# EAGLE schematic regulator (EAGLE 9.6.2)
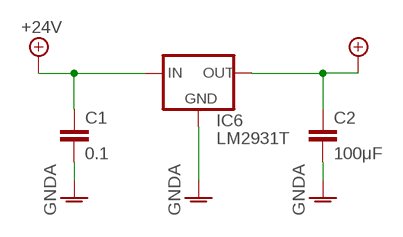
[diagram p0: schematic, sheet 1]

## Parts
C1  0.1  C2,5-3  [C2.5-3]
C2  100μF  C2,5-3  [C2.5-3]
IC6  LM2931T  [TO220S]

## Nets
+5V: C2.1 IC6.3(OUT)
+24V: C1.1 IC6.1(IN)
GNDA: C1.2 C2.2 IC6.2(GND)

## Library data of the parts
C1 C2 = capacitor-wima:C: CAPACITOR naming: grid - package width
IC6 = v-reg-3:LM2931: National Semiconductor <http://www.national.com> Low Dropout Fixed Regulator Vin up to 26V, Reverse Batterie/Load Dump/Short Circuit/Overload Protection,